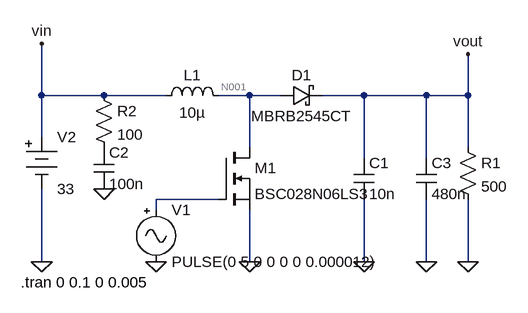
[diagram p0: schematic stepup.asc]
stepup.asc, the LTspice schematic file:
Version 4
SHEET 1 880 680
WIRE -112 160 -112 80
WIRE -16 160 -112 160
WIRE 80 160 -16 160
WIRE 208 160 160 160
WIRE 256 160 208 160
WIRE 384 160 320 160
WIRE 480 160 384 160
WIRE 544 160 544 96
WIRE 544 160 480 160
WIRE -112 224 -112 160
WIRE 208 240 208 160
WIRE 544 240 544 160
WIRE 384 256 384 160
WIRE 480 256 480 160
WIRE 160 320 64 320
WIRE 64 336 64 320
WIRE -112 416 -112 304
WIRE 208 416 208 336
WIRE 384 416 384 320
WIRE 480 416 480 320
WIRE 544 416 544 320
FLAG 208 416 0
FLAG -112 416 0
FLAG 384 416 0
FLAG 544 96 vout
FLAG -112 80 vin
FLAG 64 416 0
FLAG 544 416 0
FLAG -16 304 0
FLAG 480 416 0
SYMBOL ind 64 176 R270
WINDOW 0 32 56 VTop 2
WINDOW 3 5 56 VBottom 2
SYMATTR InstName L1
SYMATTR Value 10µ
SYMATTR SpiceLine Ipk=51 Rser=0.028 Rpar=0 Cpar=0
SYMBOL schottky 256 176 R270
WINDOW 0 32 32 VTop 2
WINDOW 3 0 32 VBottom 2
SYMATTR InstName D1
SYMATTR Value MBRB2545CT
SYMATTR Description Diode
SYMATTR Type diode
SYMBOL nmos 160 240 R0
SYMATTR InstName M1
SYMATTR Value BSC028N06LS3
SYMBOL cap 368 256 R0
SYMATTR InstName C1
SYMATTR Value 10n
SYMBOL Misc\\signal 64 320 R0
WINDOW 123 0 0 Left 2
WINDOW 39 0 0 Left 2
SYMATTR InstName V1
SYMATTR Value PULSE(0 5 0 0 0 0 0.000012)
SYMBOL Misc\\battery -112 208 R0
WINDOW 123 0 0 Left 2
WINDOW 39 0 0 Left 2
SYMATTR InstName V2
SYMATTR Value 33
SYMBOL res 528 224 R0
SYMATTR InstName R1
SYMATTR Value 500
SYMATTR SpiceLine pwr=100
SYMBOL cap -32 240 R0
SYMATTR InstName C2
SYMATTR Value 100n
SYMBOL res -32 144 R0
SYMATTR InstName R2
SYMATTR Value 100
SYMATTR SpiceLine pwr=1
SYMBOL cap 464 256 R0
SYMATTR InstName C3
SYMATTR Value 480n
TEXT -144 448 Left 2 !.tran 0 0.1 0 0.005

The netlist it stands for:
* stepup.asc
L1 vin N001 10µ Ipk=51 Rser=0.028 Rpar=0 Cpar=0
D1 N001 vout MBRB2545CT
M1 N001 N002 0 0 BSC028N06LS3
C1 vout 0 10n
V1 N002 0 PULSE(0 5 0 0 0 0 0.000012)
V2 vin 0 33
R1 vout 0 500 pwr=100
C2 P001 0 100n
R2 vin P001 100 pwr=1
C3 vout 0 480n
.model D D
.lib standard.dio
.model NMOS NMOS
.model PMOS PMOS
.lib standard.mos
.tran 0 0.1 0 0.005
.backanno
.end

* Results of the author's LTspice run, read from the files saved beside the schematic
* Operating Point, zero values left out:
*   V(vin) = 33 V
*   V(n001) = 33 V
*   V(vout) = 32.68 V
*   V(p001) = 33 V
*   I(D1) = 65.35 mA
*   I(L1) = 65.35 mA
*   I(R1) = 65.35 mA
*   I(V2) = -65.35 mA
*   Id(M1) = 48.8 pA
*   Is(M1) = -48.8 pA